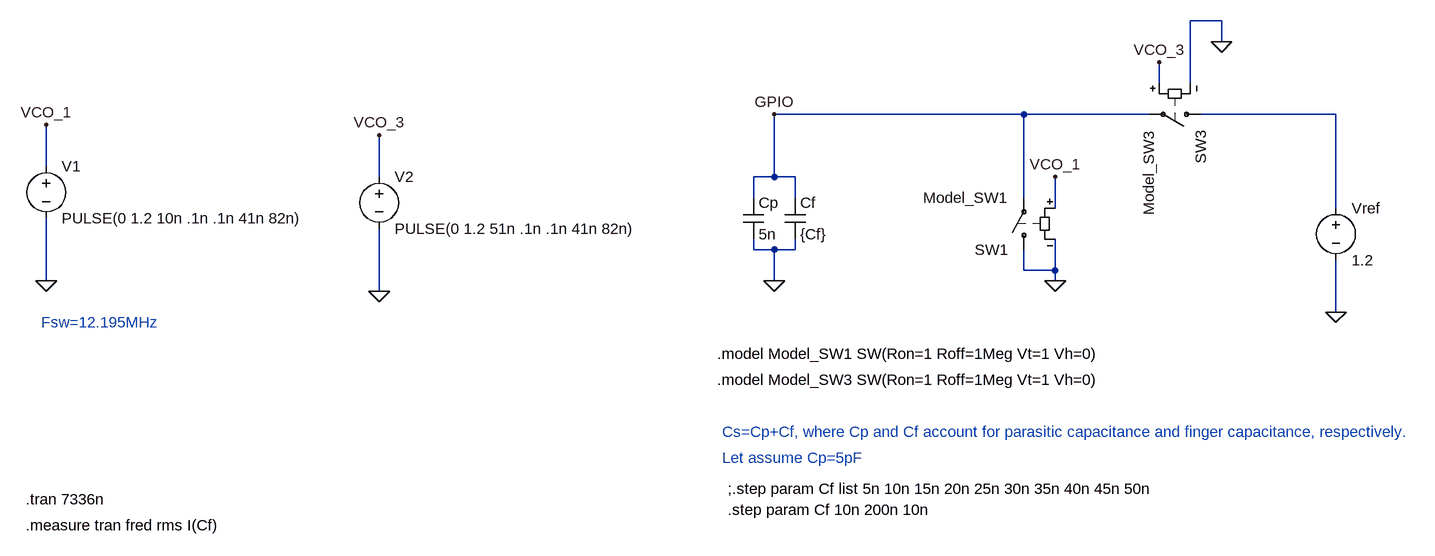
[diagram p0: schematic switch_capacitor.asc]
switch_capacitor.asc, the LTspice schematic file:
Version 4
SHEET 1 1296 680
WIRE 928 -160 880 -160
WIRE 928 -128 928 -160
WIRE 832 -64 832 -96
WIRE 880 -64 880 -160
WIRE 624 -16 240 -16
WIRE 816 -16 624 -16
WIRE 1104 -16 896 -16
WIRE -880 64 -880 0
WIRE -368 80 -368 16
WIRE 240 80 240 -16
WIRE 240 80 208 80
WIRE 272 80 240 80
WIRE 208 112 208 80
WIRE 272 112 272 80
WIRE 624 112 624 -16
WIRE 672 128 672 80
WIRE 1104 128 1104 -16
WIRE 208 192 208 176
WIRE 240 192 208 192
WIRE 272 192 272 176
WIRE 272 192 240 192
WIRE 624 224 624 192
WIRE 672 224 672 176
WIRE 672 224 624 224
WIRE -880 240 -880 144
WIRE 240 240 240 192
WIRE 672 240 672 224
WIRE -368 256 -368 160
WIRE 1104 288 1104 208
FLAG 672 240 0
FLAG -880 240 0
FLAG -368 256 0
FLAG 672 80 VCO_1
FLAG 928 -128 0
FLAG 832 -96 VCO_3
FLAG -368 16 VCO_3
FLAG -880 0 VCO_1
FLAG 1104 288 0
FLAG 240 240 0
FLAG 240 -16 GPIO
SYMBOL voltage -880 48 R0
WINDOW 123 0 0 Left 0
WINDOW 39 0 0 Left 0
SYMATTR InstName V1
SYMATTR Value PULSE(0 1.2 10n .1n .1n 41n 82n)
SYMBOL voltage -368 64 R0
WINDOW 123 0 0 Left 0
WINDOW 39 0 0 Left 0
SYMATTR InstName V2
SYMATTR Value PULSE(0 1.2 51n .1n .1n 41n 82n)
SYMBOL sw 624 208 R180
SYMATTR InstName SW1
SYMATTR Value Model_SW1
SYMBOL sw 912 -16 R90
SYMATTR InstName SW3
SYMATTR Value Model_SW3
SYMBOL voltage 1104 112 R0
WINDOW 123 0 0 Left 0
WINDOW 39 0 0 Left 0
SYMATTR InstName Vref
SYMATTR Value 1.2
SYMBOL cap 192 112 R0
SYMATTR InstName Cp
SYMATTR Value 5n
SYMBOL cap 256 112 R0
SYMATTR InstName Cf
SYMATTR Value {Cf}
TEXT 152 352 Left 2 !.model Model_SW1 SW(Ron=1 Roff=1Meg Vt=1 Vh=0)
TEXT 152 392 Left 2 !.model Model_SW3 SW(Ron=1 Roff=1Meg Vt=1 Vh=0)
TEXT -888 304 Left 2 ;Fsw=12.195MHz
TEXT 160 472 Left 2 ;Cs=Cp+Cf, where Cp and Cf account for parasitic capacitance and finger capacitance, respectively.
TEXT 160 512 Left 2 ;Let assume Cp=5pF
TEXT -912 576 Left 2 !.tran 7336n
TEXT 168 560 Left 2 !;.step param Cf list 5n 10n 15n 20n 25n 30n 35n 40n 45n 50n
TEXT -912 616 Left 2 !.measure tran fred rms I(Cf)
TEXT 168 592 Left 2 !.step param Cf 10n 200n 10n

The netlist it stands for:
* switch_capacitor.asc
V1 VCO_1 0 PULSE(0 1.2 10n .1n .1n 41n 82n)
V2 VCO_3 0 PULSE(0 1.2 51n .1n .1n 41n 82n)
SW1 0 GPIO VCO_1 0 Model_SW1
SW3 N001 GPIO VCO_3 0 Model_SW3
Vref N001 0 1.2
Cp GPIO 0 5n
Cf GPIO 0 {Cf}
.model Model_SW1 SW(Ron=1 Roff=1Meg Vt=1 Vh=0)
.model Model_SW3 SW(Ron=1 Roff=1Meg Vt=1 Vh=0)
* Fsw=12.195MHz
* Cs=Cp+Cf, where Cp and Cf account for parasitic capacitance and finger capacitance, respectively.
* Let assume Cp=5pF
.tran 7336n
;.step param Cf list 5n 10n 15n 20n 25n 30n 35n 40n 45n 50n
.measure tran fred rms I(Cf)
.step param Cf 10n 200n 10n
.backanno
.end